# Altium schematic sheet UART TO USB LOG.SchDoc
size A; SheetNumber: 3; SheetTotal: 7
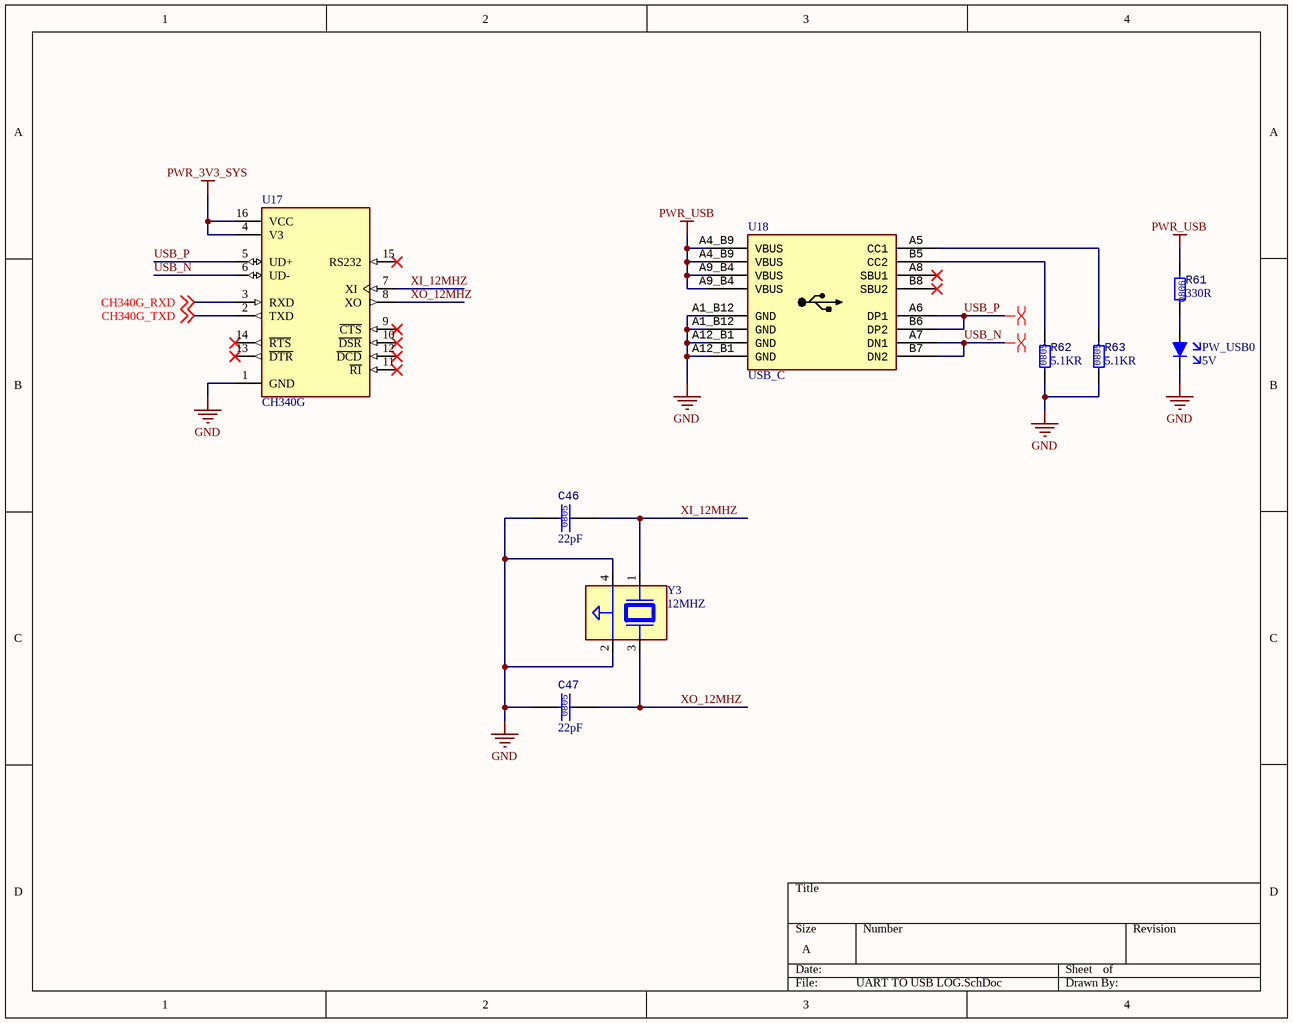
[diagram p0: UART TO USB LOG.SchDoc]

## Parts
C46  Size: 0805  [CAPCER 0805 SMD]  (hidden comment: 22pF)
C47  Size: 0805  [CAPCER 0805 SMD]  (hidden comment: 22pF)
PW_USB0  value 5V  [LED 0805 SMD]  (hidden comment: LED_RED)
R61  Size: 0806  [RESC 0805 SMD]  (hidden comment: 330R)
R62  Size: 0805  [RESC 0805 SMD]  (hidden comment: 5.1KR)
R63  Size: 0805  [RESC 0805 SMD]  (hidden comment: 5.1KR)
U17  CH340G  [SOP-16]
U18  value USB_C  [TYPEC-16POS]  (hidden comment: USB_TYPE_C)
Y3  value 12MHZ  [XTAL_5032]  (hidden comment: XTAL_12Mhz)

## Nets
GND: C46.1 C47.1 PW_USB0.C(K) R62.1 R63.1 U17.1(GND) U18.A1_B12(GND) U18.A12_B1(GND) Y3.2(GND) Y3.4(GND)
PWR_3V3_SYS: U17.4(V3) U17.16(VCC)
PWR_USB: R61.1 U18.A4_B9(VBUS) U18.A9_B4(VBUS)
CH340G_RXD: U17.3(RXD) ; off-sheet CH340G_RXD
CH340G_TXD: U17.2(TXD) ; off-sheet CH340G_TXD
USB_N: U17.6(UD-) U18.A7(DN1) U18.B7(DN2)
USB_P: U17.5(UD+) U18.A6(DP1) U18.B6(DP2)
XI_12MHZ: C46.2 U17.7(XI) Y3.1
XO_12MHZ: C47.2 U17.8(XO) Y3.3
NetPW_USB0_A: PW_USB0.A R61.2
NetR62_2: R62.2 U18.B5(CC2)
NetR63_2: R63.2 U18.A5(CC1)

Not connected (* = marked no-connect by the designer): U17 9(~{CTS})* 10(~{DSR})* 11(~{RI})* 12(~{DCD})* 13(~{DTR})* 14(~{RTS})* 15(RS232)*; U18 A8(SBU1)* B8(SBU2)*

## Layout directives
differential pair: USB_N, USB_P

## Library data of the parts
C46 C47 = DB-0047: CAPACITOR SMD 22pF 50V 10% 0805; Design Item ID: DB-0047; Value: 22pF; Type: CAPACITOR; Power Rate: N/A; Tolerance: 10%; Footprint Type: SMD; Supplier: THEGIOIIC; Supplier Part Number: Tụ Gốm 0805 22pF 50V; Supplier Link: https://www.thegioiic.com/tu-gom-0805-22pf-50v
PW_USB0 = DB-0020: Size 2x1.2mm, điện áp 1.8-2.6VDC; Design Item ID: DB-0020; Type: LED; Power Rate: N/A; Tolerance: N/A; Footprint Type: SMD; Size: 0806; Supplier: THEGIOIIC; Supplier Part Number: LED Đỏ 0805 Dán SMD Trong Suốt Harvatek; Supplier Link: https://www.thegioiic.com/led-do-0805-dan-smd-trong-suot-harvatek
R61 = DB-0048: RESISTOR SMD 330R OHM 1% 125mW 0805; Power Rate: 125mW; Value: 330R; Design Item ID: DB-0048; Type: RESISTOR; Tolerance: 1%; Footprint Type: SMD; Supplier: THEGIOIIC; Supplier Part Number: Điện Trở 330 Ohm 0805 1%; Supplier Link: https://www.thegioiic.com/dien-tro-330-ohm-0805-1-
R62 R63 = DB-0002: Power Rate: *; Design Item ID: DB-0002; Value: 5.1KR; Type: RESISTOR; Footprint Type: SMD; Supplier: THEGIOIIC; Supplier Link: https://www.thegioiic.com/dien-tro-5-1-kohm-0805-1-
U17 = DB-0087: Design Item ID: DB-0087; Value: CH340G
U18 = DB-0088: Design Item ID: DB-0088; Type: USB
Y3 = DB-0001: Design Item ID: DB-0001; Type: XTAL; Footprint Type: SMD; Size: 5033; Supplier: THEGIOIIC; Supplier Link: https://www.thegioiic.com/thach-anh-12mhz-5032-4-chan-smd